# EAGLE design AudioBoard_1_1_0 (EAGLE 5.11)
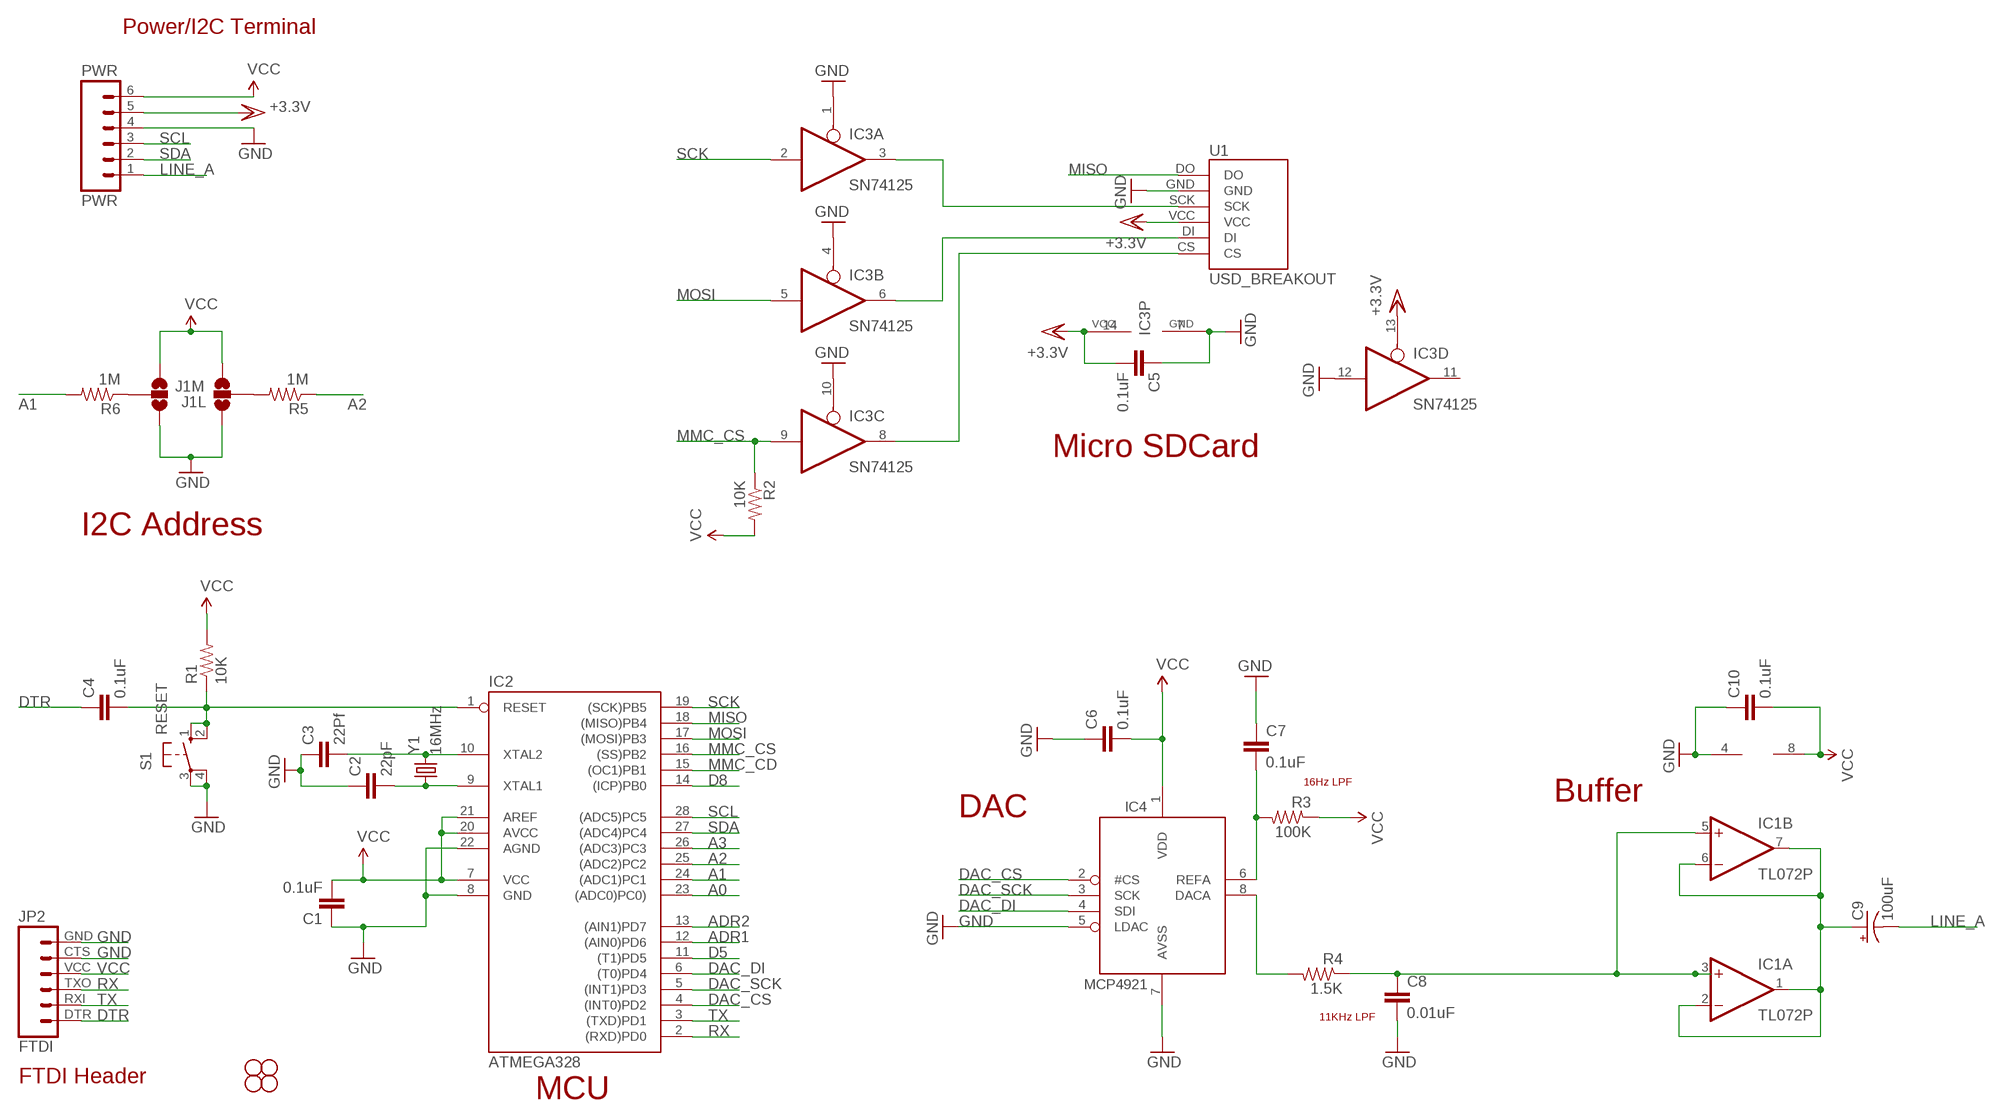
[diagram p0: schematic, sheet 1]

## Parts
C1  0.1uF  CAPPTH  [CAP-PTH-SMALL]
C2  22pF  CAPPTH  [CAP-PTH-SMALL]
C3  22Pf  CAPPTH  [CAP-PTH-SMALL]
C4  0.1uF  CAPPTH  [CAP-PTH-SMALL]
C5  0.1uF  CAPPTH  [CAP-PTH-SMALL]
C6  0.1uF  CAPPTH  [CAP-PTH-SMALL]
C7  0.1uF  CAPPTH  [CAP-PTH-SMALL]
C8  0.01uF  CAPPTH  [CAP-PTH-SMALL]
C9  100uF  CAP_POLPTH1  [CPOL-RADIAL-100UF-25V]
C10  0.1uF  CAPPTH  [CAP-PTH-SMALL]
IC1  TL072P  [DIL08]
IC2  ATMEGA328  AT90S4433P  [DIL28-3]
IC3  SN74125  74125N  [DIL14]
IC4  MCP4921  [DIL08]
J1L  SOLDERJUMPER_2WAY-OLDT  [SJ_2]
J1M  SOLDERJUMPER_2WAY-OLDT  [SJ_2]
JP1  STAND-OFF  [STAND-OFF]
JP2  FTDI  FTDI_BASICPTH  [FTDI_BASIC]
JP3  STAND-OFF  [STAND-OFF]
JP4  STAND-OFF  [STAND-OFF]
JP5  STAND-OFF  [STAND-OFF]
PWR  PWR  M06POLAR  [MOLEX-1X6]
R1  10K  RESISTORPTH-1/4W  [AXIAL-0.4]
R2  10K  RESISTORPTH-1/2W  [AXIAL-0.5]
R3  100K  RESISTORAXIAL-0.3  [AXIAL-0.3]
R4  1.5K  RESISTORAXIAL-0.3  [AXIAL-0.3]
R5  1M  RESISTORPTH-1/4W  [AXIAL-0.4]
R6  1M  RESISTORPTH-1/4W  [AXIAL-0.4]
S1  RESET  10-XX  [B3F-10XX]
U1  USD_BREAKOUT  USD_BREAKOUTNOCD  [USD_BREAKOUT]
Y1  16MHz  CRYSTALHC49US  [HC49US]

## Nets
A0: IC2.23((ADC0)PC0))
A1: IC2.24((ADC1)PC1) R6.P$2
A2: IC2.25((ADC2)PC2) R5.P$1
A3: IC2.26((ADC3)PC3)
ADR1: IC2.12((AIN0)PD6)
ADR2: IC2.13((AIN1)PD7)
D5: IC2.11((T1)PD5)
D8: IC2.14((ICP)PB0)
DAC_CS: IC2.4((INT0)PD2) IC4.2(#CS)
DAC_DI: IC2.6((T0)PD4) IC4.4(SDI)
DAC_SCK: IC2.5((INT1)PD3) IC4.3(SCK)
DTR: C4.1 JP2.DTR
GND: C1.1 C2.1 C3.1 C5.1 C6.1 C7.1 C8.2 C10.1 IC1.4(P:V-) IC2.8(GND) IC2.22(AGND) IC3.1(A:OE) IC3.4(B:OE) IC3.7(P:GND) IC3.10(C:OE) IC3.12(D:I) IC4.5(LDAC) IC4.7(AVSS) J1L.1 J1M.3 JP2.CTS JP2.GND PWR.4 S1.3(P) S1.4(P1) U1.GND
LINE_A: C8.1 C9.2(-) IC1.3(A:+IN) IC1.5(B:+IN) PWR.1 R4.P$1
MISO: IC2.18((MISO)PB4) U1.DO
MMC_CD: IC2.15((OC1)PB1)
MMC_CS: IC2.16((SS)PB2) IC3.9(C:I) R2.P$1
MOSI: IC2.17((MOSI)PB3) IC3.5(B:I)
N$1: IC3.8(C:O) U1.CS
N$2: IC3.6(B:O) U1.DI
N$3: C4.2 IC2.1(RESET) R1.P$1 S1.1(S) S1.2(S1)
N$4: J1L.2 R5.P$2
N$5: IC3.3(A:O) U1.SCK
N$6: J1M.2 R6.P$1
N$7: IC4.8(DACA) R4.P$2
N$8: C9.1(+) IC1.1(A:OUT) IC1.2(A:-IN) IC1.6(B:-IN) IC1.7(B:OUT)
N$19: C7.2 IC4.6(REFA) R3.P$2
RX: IC2.2((RXD)PD0) JP2.TXO
SCK: IC2.19((SCK)PB5) IC3.2(A:I)
SCL: IC2.28((ADC5)PC5) PWR.3
SDA: IC2.27((ADC4)PC4) PWR.2
TX: IC2.3((TXD)PD1) JP2.RXI
VCC: C1.2 C6.2 C10.2 IC1.8(P:V+) IC2.7(VCC) IC2.20(AVCC) IC2.21(AREF) IC4.1(VDD) J1L.3 J1M.1 JP2.VCC PWR.6 R1.P$2 R2.P$2 R3.P$1
VCC/2: C5.2 IC3.13(D:OE) IC3.14(P:VCC) PWR.5 U1.VCC ; supply symbol labelled +3.3V
XTAL1: C2.2 IC2.9(XTAL1) Y1.1
XTAL2: C3.2 IC2.10(XTAL2) Y1.2
Unconnected: IC3.11(D:O)

## Notes on the sheet
- Power/I2C Terminal
- Micro SDCard
- I2C Address
- 16Hz LPF
- Buffer
- DAC
- 11KHz LPF
- FTDI Header
- MCU

## Library data of the parts
C1-C8 C10 = SparkFun:CAP: Capacitor Standard 0603 ceramic capacitor, and 0.1" leaded capacitor.
C9 = SparkFun:CAP_POL: Capacitor Polarized These are standard SMD and PTH capacitors. Normally 10uF, 47uF, and 100uF in electrolytic and tantalum varieties. Always verify the external diameter of the through hole cap, it varies with capacity, voltage, and manufacturer. The EIA devices should be standard.
IC1 = linear:TL072: OP AMP
IC2 = atmel:AT90S4433: MICROCONTROLLER 4 Kbytes FLASH 128 bytes SRAM 256 bytes EEPROM UART 6-channel 10 bit ADC; OC_FARNELL: unknown; OC_NEWARK: unknown
IC3 = adafruit:74*125: Quad bus BUFFER, 3-state
IC4 = adafruit:MCP4921
J1L J1M = SparkFun:SOLDERJUMPER_2WAY-OLD: Solder Jumper 2 way solder jumper
JP1 JP3-JP5 = SparkFun:STAND-OFF: Stand Off This is the mechanical footprint for a #4 phillips button head screw. Use the keepout ring to avoid running the screw head into surrounding components. SKU : PRT-00447
JP2 = SparkFun:FTDI_BASIC: FTDI Basic: 3.3V and 5V
PWR = SparkFun:M06: Header 6 Standard 6-pin 0.1" header. Use with straight break away headers (SKU : PRT-00116), right angle break away headers (PRT-00553), swiss pins (PRT-00743), machine pins (PRT-00117), and female headers (PRT-00115). Molex polarized connector foot print use with SKU : PRT-08094 with associated crimp pins and housings. NOTES ON THE VARIANTS LOCK and LOCK_LONGPADS... This footprint was designed to help hold the alignment of a through-hole component (i.e. 6-pin header) while soldering it into place. You may notice that each hole has been shifted either up or down by 0.005 of an inch from it's more standard position (which is a perfectly straight line). This slight alteration caused the pins (the squares in the middle) to touch the edges of the holes. Because they are alternating, it causes a "brace" to hold the component in place. 0.005 has proven to be the perfect amount of "off-center" position when using our standard breakaway headers. Although looks a little odd when you look at the bare footprint, once you have a header in there, the alteration is very hard to notice. Also, if you push a header all the way into place, it is covered up entirely on the bottom side. This idea of altering the position of holes to aid alignment will be further integrated into the Sparkfun Library for other footprints. It can help hold any component with 3 or more connection pins.
R1-R6 = SparkFun:RESISTOR: Resistor Basic schematic elements and footprints for 0603, 1206, and PTH resistors.
S1 = switch-omron:10-XX: OMRON SWITCH; MPN: B3F-1000; OC_FARNELL: 176432; OC_NEWARK: 36M3542
U1 = Dek:USD_BREAKOUT
Y1 = SparkFun:CRYSTAL: Crystals Various standard crystals. Proven footprints. Spark Fun Electronics SKU : COM-00534

## Board
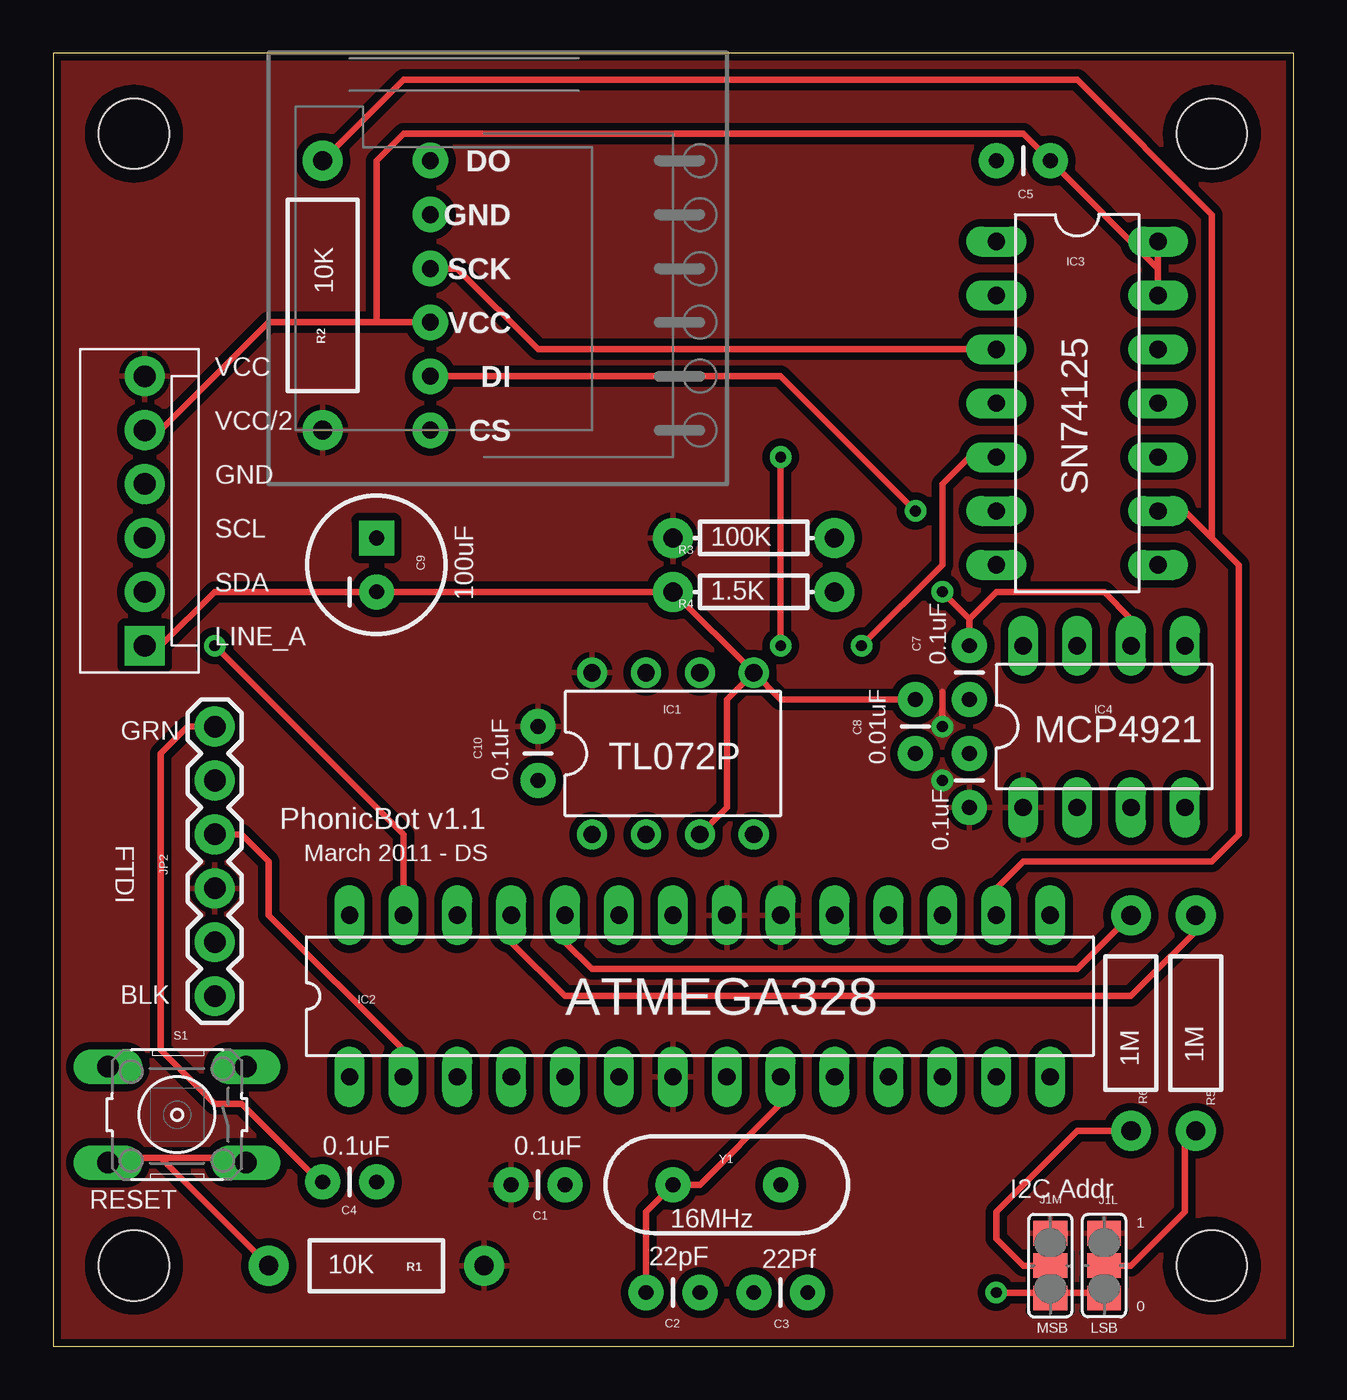
[diagram p1: board, top side]
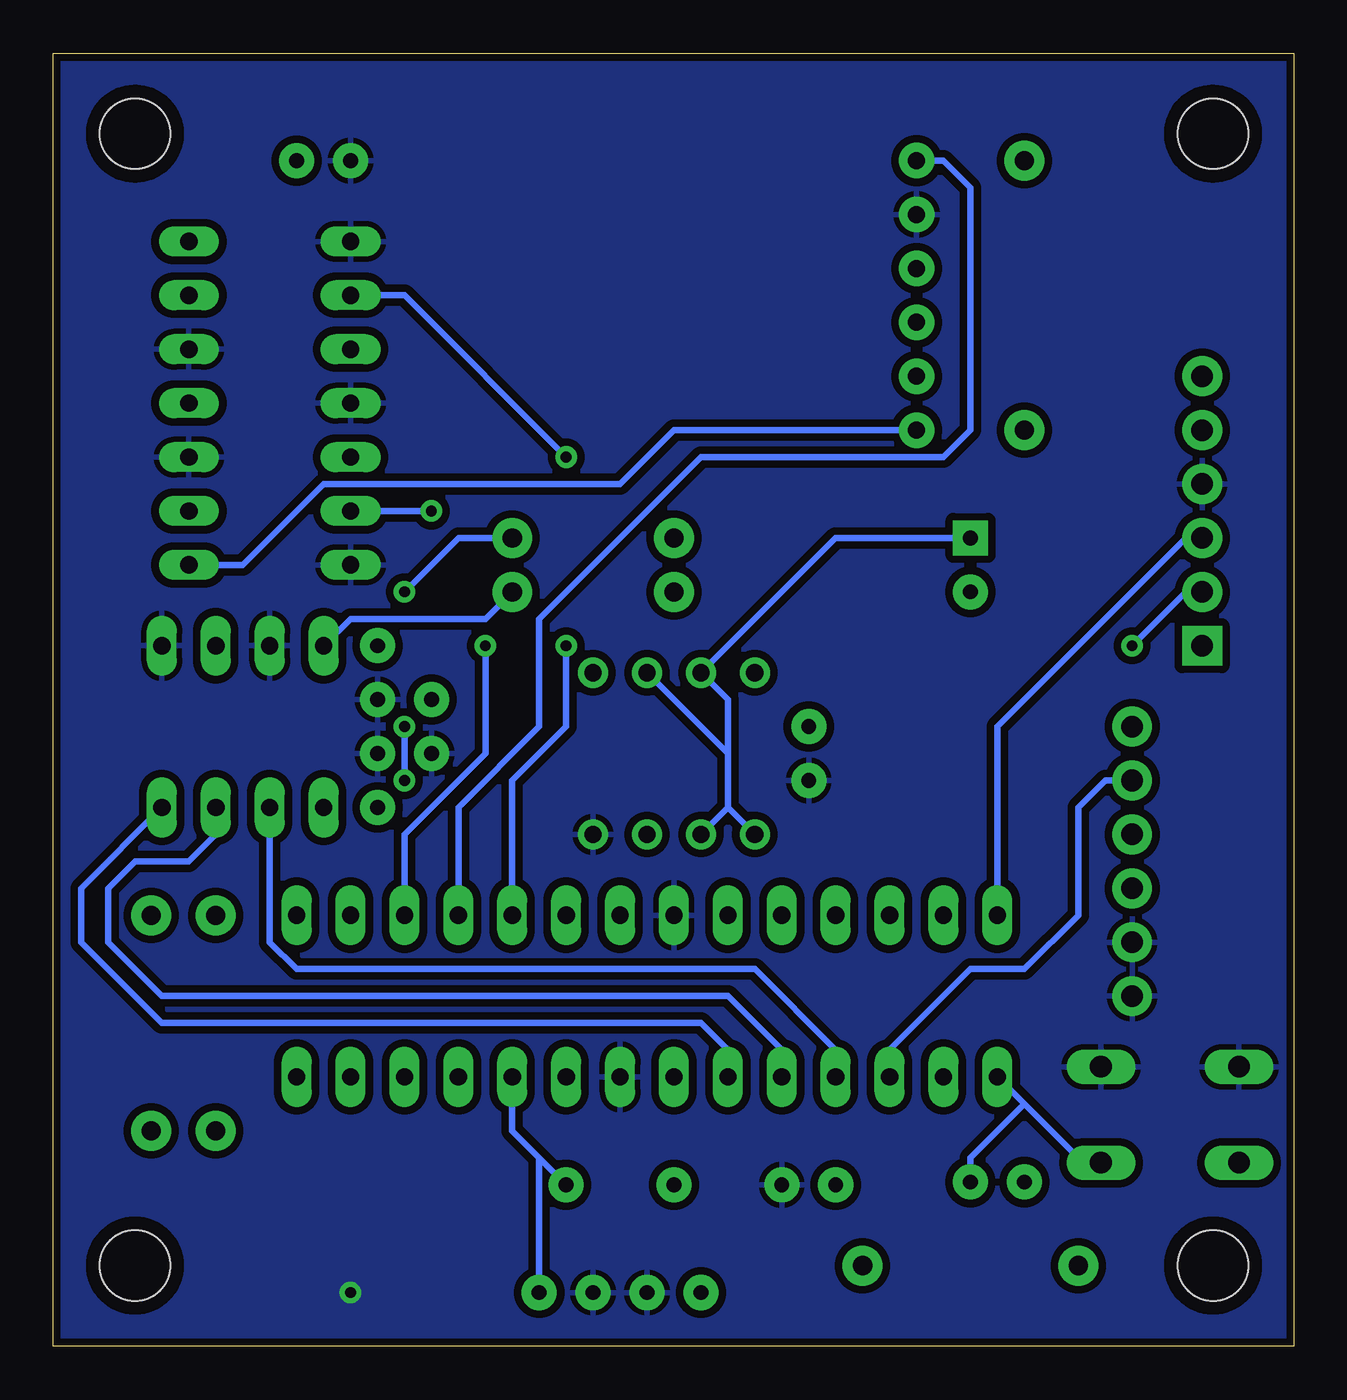
[diagram p2: board, bottom side, seen from below]

Size 58.47 x 60.95 mm. Coordinates in mm from the lower left corner, seen from the top.
Outline: 0,0 58.47,0 58.47,60.95 0,60.95 0,0
Copper layers (1*16): Top 0.035mm / dielectric 1.5mm / Bottom 0.035mm
Design rules "SparkFun": minimum track width 12mil, minimum drill 20mil, track to track 8mil, track to pad 8mil, pad to pad 8mil, via to via 8mil, smd to smd 8mil, copper to edge 10mil, drill to drill 8mil, minimum pad ring 12mil, minimum via ring 10mil, stop-mask expansion 4mil, vias tented up to drill 25mil, thermal gap 10mil

### Footprints (pad centres in the part's own frame; a part is rotated, then mirrored left to right if it is on the bottom)
CAP-PTH-SMALL = drill 0.7 pad 1.651 round: 1 0,0; 2 2.54,0
CPOL-RADIAL-100UF-25V = drill 0.7 pad 1.651 square: 1 1.27,0 | drill 0.7 pad 1.651 round: 2 -1.27,0
DIL08 = drill 0.813 pad 1.27 round: 1 -3.81,-3.81; 2 -1.27,-3.81; 3 1.27,-3.81; 4 3.81,-3.81; 5 3.81,3.81; 6 1.27,3.81; 7 -1.27,3.81; 8 -3.81,3.81
DIL28-3 = drill 0.813 long: 1 -16.51,-3.81; 2 -13.97,-3.81; 3 -11.43,-3.81; 4 -8.89,-3.81; 5 -6.35,-3.81; 6 -3.81,-3.81; 7 -1.27,-3.81; 8 1.27,-3.81; 9 3.81,-3.81; 10 6.35,-3.81; 11 8.89,-3.81; 12 11.43,-3.81; 13 13.97,-3.81; 14 16.51,-3.81; 15 16.51,3.81; 16 13.97,3.81; 17 11.43,3.81; 18 8.89,3.81; 19 6.35,3.81; 20 3.81,3.81; 21 1.27,3.81; 22 -1.27,3.81; 23 -3.81,3.81; 24 -6.35,3.81; 25 -8.89,3.81; 26 -11.43,3.81; 27 -13.97,3.81; 28 -16.51,3.81
DIL14 = drill 0.813 long: 1 -7.62,-3.81; 2 -5.08,-3.81; 3 -2.54,-3.81; 4 0,-3.81; 5 2.54,-3.81; 6 5.08,-3.81; 7 7.62,-3.81; 8 7.62,3.81; 9 5.08,3.81; 10 2.54,3.81; 11 0,3.81; 12 -2.54,3.81; 13 -5.08,3.81; 14 -7.62,3.81
DIL08' = drill 0.813 long: 1 -3.81,-3.81; 2 -1.27,-3.81; 3 1.27,-3.81; 4 3.81,-3.81; 5 3.81,3.81; 6 1.27,3.81; 7 -1.27,3.81; 8 -3.81,3.81
SJ_2 = smd 1.168 x 1.6: 1 -1.524,0; 2 0,0; 3 1.524,0
STAND-OFF = hole 3.302: 0,0
FTDI_BASIC = drill 1.016 pad 1.88 round: CTS 10.16,0; DTR 0,0; GND 12.7,0; RXI 2.54,0; TXO 5.08,0; VCC 7.62,0
MOLEX-1X6 = drill 1.016 pad 1.88 square: 1 0,0 | drill 1.016 pad 1.88 round: 2 2.54,0; 3 5.08,0; 4 7.62,0; 5 10.16,0; 6 12.7,0
AXIAL-0.4 = drill 0.9 pad 1.88 round: P$1 -5.08,0; P$2 5.08,0
AXIAL-0.5 = drill 0.9 pad 1.88 round: P$1 -6.35,0; P$2 6.35,0
AXIAL-0.3 = drill 0.9 pad 1.88 round: P$1 -3.81,0; P$2 3.81,0
B3F-10XX = drill 1.016 long: 1 -3.251,2.261; 2 3.251,2.261; 3 -3.251,-2.261; 4 3.251,-2.261
USD_BREAKOUT = drill 0.8 pad 1.676 round: CS 7.62,2.54; DI 7.62,5.08; DO 7.62,15.24; GND 7.62,12.7; SCK 7.62,10.16; VCC 7.62,7.62
HC49US = drill 0.7 pad 1.651 round: 1 -2.54,0; 2 2.54,0

### Placement (x,y rotation side)
C1  24.13,7.62 180 top
C2  30.48,2.54 180 top
C3  33.02,2.54 0 top
C4  12.7,7.75 0 top
C5  44.45,55.88 0 top
C6  43.18,27.94 270 top
C7  43.18,30.48 90 top
C8  40.64,30.48 270 top
C9  15.24,36.83 90 top
C10  22.86,26.67 90 top
IC1  29.21,27.94 0 top
IC2  30.48,16.51 0 top
IC3  48.26,44.45 270 top
IC4  MCP4921  [DIL08']  49.53,29.21 0 top
J1L  49.53,3.81 90 top
J1M  46.99,3.81 270 top
JP1  3.81,3.81 0 top
JP2  7.62,29.21 270 top
JP3  54.61,57.15 0 top
JP4  3.81,57.15 0 top
JP5  54.61,3.81 0 top
PWR  4.32,33.02 90 top
R1  15.24,3.81 0 top
R2  12.7,49.53 270 top
R3  33.02,38.1 0 top
R4  33.02,35.56 0 top
R5  53.85,15.24 270 top
R6  50.8,15.24 90 top
S1  5.84,10.92 180 top
U1  10.16,40.64 0 top
Y1  31.75,7.62 0 top

### Tracks (layer width: path | path; a pad name or v marks a point on that pad's centre or on a via)
A1
  Top 0.305: IC2.24 24.13,19.05 25.4,17.78 48.26,17.78 R6.P$2
A2
  Top 0.305: IC2.25 21.59,19.05 24.13,16.51 50.8,16.51 54.61,20.32 R5.P$1
DAC_CS
  Bottom 0.305: IC2.4 21.59,13.97 25.4,17.78 46.99,17.78 48.26,19.05 IC4.2
DAC_DI
  Bottom 0.305: IC2.6 26.67,13.97 27.94,15.24 53.34,15.24 57.15,19.05 57.15,21.59 IC4.4
DAC_SCK
  Bottom 0.305: IC2.5 24.13,13.97 26.67,16.51 53.34,16.51 55.88,19.05 55.88,21.59 54.61,22.86 52.07,22.86 50.8,24.13 IC4.3
DTR
  Top 0.305: JP2.DTR 6.35,29.21 5.08,27.94 5.08,13.97 7.62,11.43 8.89,11.43 12.7,7.62 C4.1
GND  (via drill 0.51)
  Top 0.305: 46.99,2.54 49.53,2.54 J1L.1 | 46.99,2.54 v44.45,2.54 | J1M.3 46.99,2.54
  pour Bottom (isolate 0.356): -1.27,62.23 59.69,62.23 59.69,-1.27 -1.27,-1.27
LINE_A
  Top 0.305: PWR.1 5.08,33.02 7.62,35.56 C9.2 R4.P$1 IC1.5 | IC1.3 31.75,25.4 31.75,30.48 IC1.5 | C8.1 34.29,30.48 IC1.5
MISO
  Bottom 0.305: IC2.18 39.37,25.4 35.56,29.21 35.56,34.29 27.94,41.91 16.51,41.91 15.24,43.18 15.24,54.61 16.51,55.88 U1.DO
MMC_CS
  Top 0.305: IC2.16 44.45,21.59 45.72,22.86 54.61,22.86 55.88,24.13 55.88,36.83 54.61,38.1 | 54.61,38.1 53.34,39.37 IC3.9 | R2.P$1 16.51,59.69 48.26,59.69 54.61,53.34 54.61,38.1
MOSI  (via drill 0.51)
  Top 0.305: v38.1,33.02 41.91,36.83 41.91,40.64 43.18,41.91 IC3.5
  Bottom 0.305: IC2.17 41.91,24.13 38.1,27.94 v38.1,33.02
N$1
  Bottom 0.305: IC3.8 49.53,36.83 45.72,40.64 31.75,40.64 29.21,43.18 U1.CS
N$2  (via drill 0.51)
  Top 0.305: v40.64,39.37 34.29,45.72 U1.DI
  Bottom 0.305: v40.64,39.37 IC3.6
N$3
  Top 0.305: 5.08,8.89 8.89,8.89 S1.1 | 5.08,8.89 3.81,8.89 S1.2 | 5.08,8.89 R1.P$1
  Bottom 0.305: 12.7,11.43 10.16,8.89 S1.1 | 12.7,11.43 IC2.1 | 12.7,11.43 15.24,8.89 C4.2 15.24,7.62
N$4
  Top 0.305: J1L.2 50.8,3.81 53.34,6.35 53.34,10.16 R5.P$2
N$5
  Top 0.305: IC3.3 22.86,46.99 19.05,50.8 U1.SCK
N$6
  Top 0.305: J1M.2 45.72,3.81 44.45,5.08 44.45,6.35 48.26,10.16 R6.P$1
N$7
  Bottom 0.305: IC4.8 44.45,34.29 38.1,34.29 R4.P$2
N$8
  Bottom 0.305: IC1.1 26.67,25.4 | 26.67,25.4 IC1.2 | 26.67,25.4 26.67,27.94 | 26.67,27.94 26.67,30.48 IC1.7 21.59,38.1 C9.1 | 26.67,27.94 IC1.6
N$19  (via drill 0.51)
  Top 0.305: IC4.6 50.8,34.29 49.53,35.56 44.45,35.56 43.18,34.29 | 43.18,34.29 C7.2 | v41.91,35.56 43.18,34.29
  Bottom 0.305: R3.P$2 39.37,38.1 v41.91,35.56
RX
  Top 0.305: IC2.2 16.51,13.97 10.16,20.32 10.16,22.86 8.89,24.13 JP2.TXO
SCK  (via drill 0.51)
  Top 0.305: v34.29,33.02 v34.29,41.91
  Bottom 0.305: IC2.19 36.83,26.67 34.29,29.21 v34.29,33.02 | v34.29,41.91 41.91,49.53 IC3.2
SCL
  Bottom 0.305: IC2.28 13.97,29.21 5.08,38.1 PWR.3
SDA  (via drill 0.51)
  Top 0.305: IC2.27 16.51,24.13 v7.62,33.02
  Bottom 0.305: v7.62,33.02 5.08,35.56 PWR.2
TX
  Bottom 0.305: IC2.3 19.05,13.97 15.24,17.78 12.7,17.78 10.16,20.32 10.16,25.4 8.89,26.67 JP2.RXI
VCC  (via drill 0.51)
  Top 0.305: v41.91,29.21 41.91,30.83
  Bottom 0.305: v41.91,26.67 v41.91,29.21
  pour Top (isolate 0.356): -1.27,62.23 59.69,62.23 59.69,-1.27 -1.27,-1.27
VCC/2
  Top 0.305: 52.07,50.8 IC3.14 | 52.07,50.8 IC3.13 | 52.07,50.8 C5.2 45.72,57.15 16.51,57.15 15.24,55.88 15.24,48.26 | 15.24,48.26 10.16,48.26 5.08,43.18 PWR.5 | 15.24,48.26 U1.VCC
XTAL1
  Top 0.305: IC2.9 34.29,11.43 30.48,7.62 Y1.1 27.94,6.35 C2.2
XTAL2
  Bottom 0.305: IC2.10 36.83,10.16 35.56,8.89 | 35.56,8.89 Y1.2 | C3.2 35.56,8.89

### Text on the board
tPlace: VCC | VCC/2 | GND | SCL | SDA | LINE_A | GRN | PhonicBot v1.1 | March 2011 - DS | BLK | I2C Addr | 1 | 0 | MSB | LSB